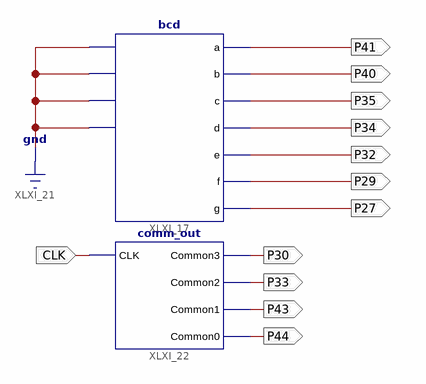
[diagram p0: schematic sheet 1]
// Xilinx ISE schematic main.sch (spartan6) as structural Verilog: 2 symbols, 12 ports
module main (
  input  CLK,
  output P41,
  output P40,
  output P35,
  output P34,
  output P32,
  output P29,
  output P27,
  output P30,
  output P33,
  output P43,
  output P44
);

  bcd XLXI_17 (
    .a(P41), .b(P40), .c(P35), .d(P34), .e(P32), .f(P29), .g(P27), .In_A(1'b0), .In_B(1'b0), .In_C(1'b0),
    .In_D(1'b0));
  comm_out XLXI_22 (.CLK(CLK), .Common3(P30), .Common2(P33), .Common1(P43), .Common0(P44));

  // Notes on the sheet:
  //   CLOCK_DEDICATED_ROUTE on signal CLK = False
endmodule
